# EAGLE design Dot (EAGLE 9.2.2)
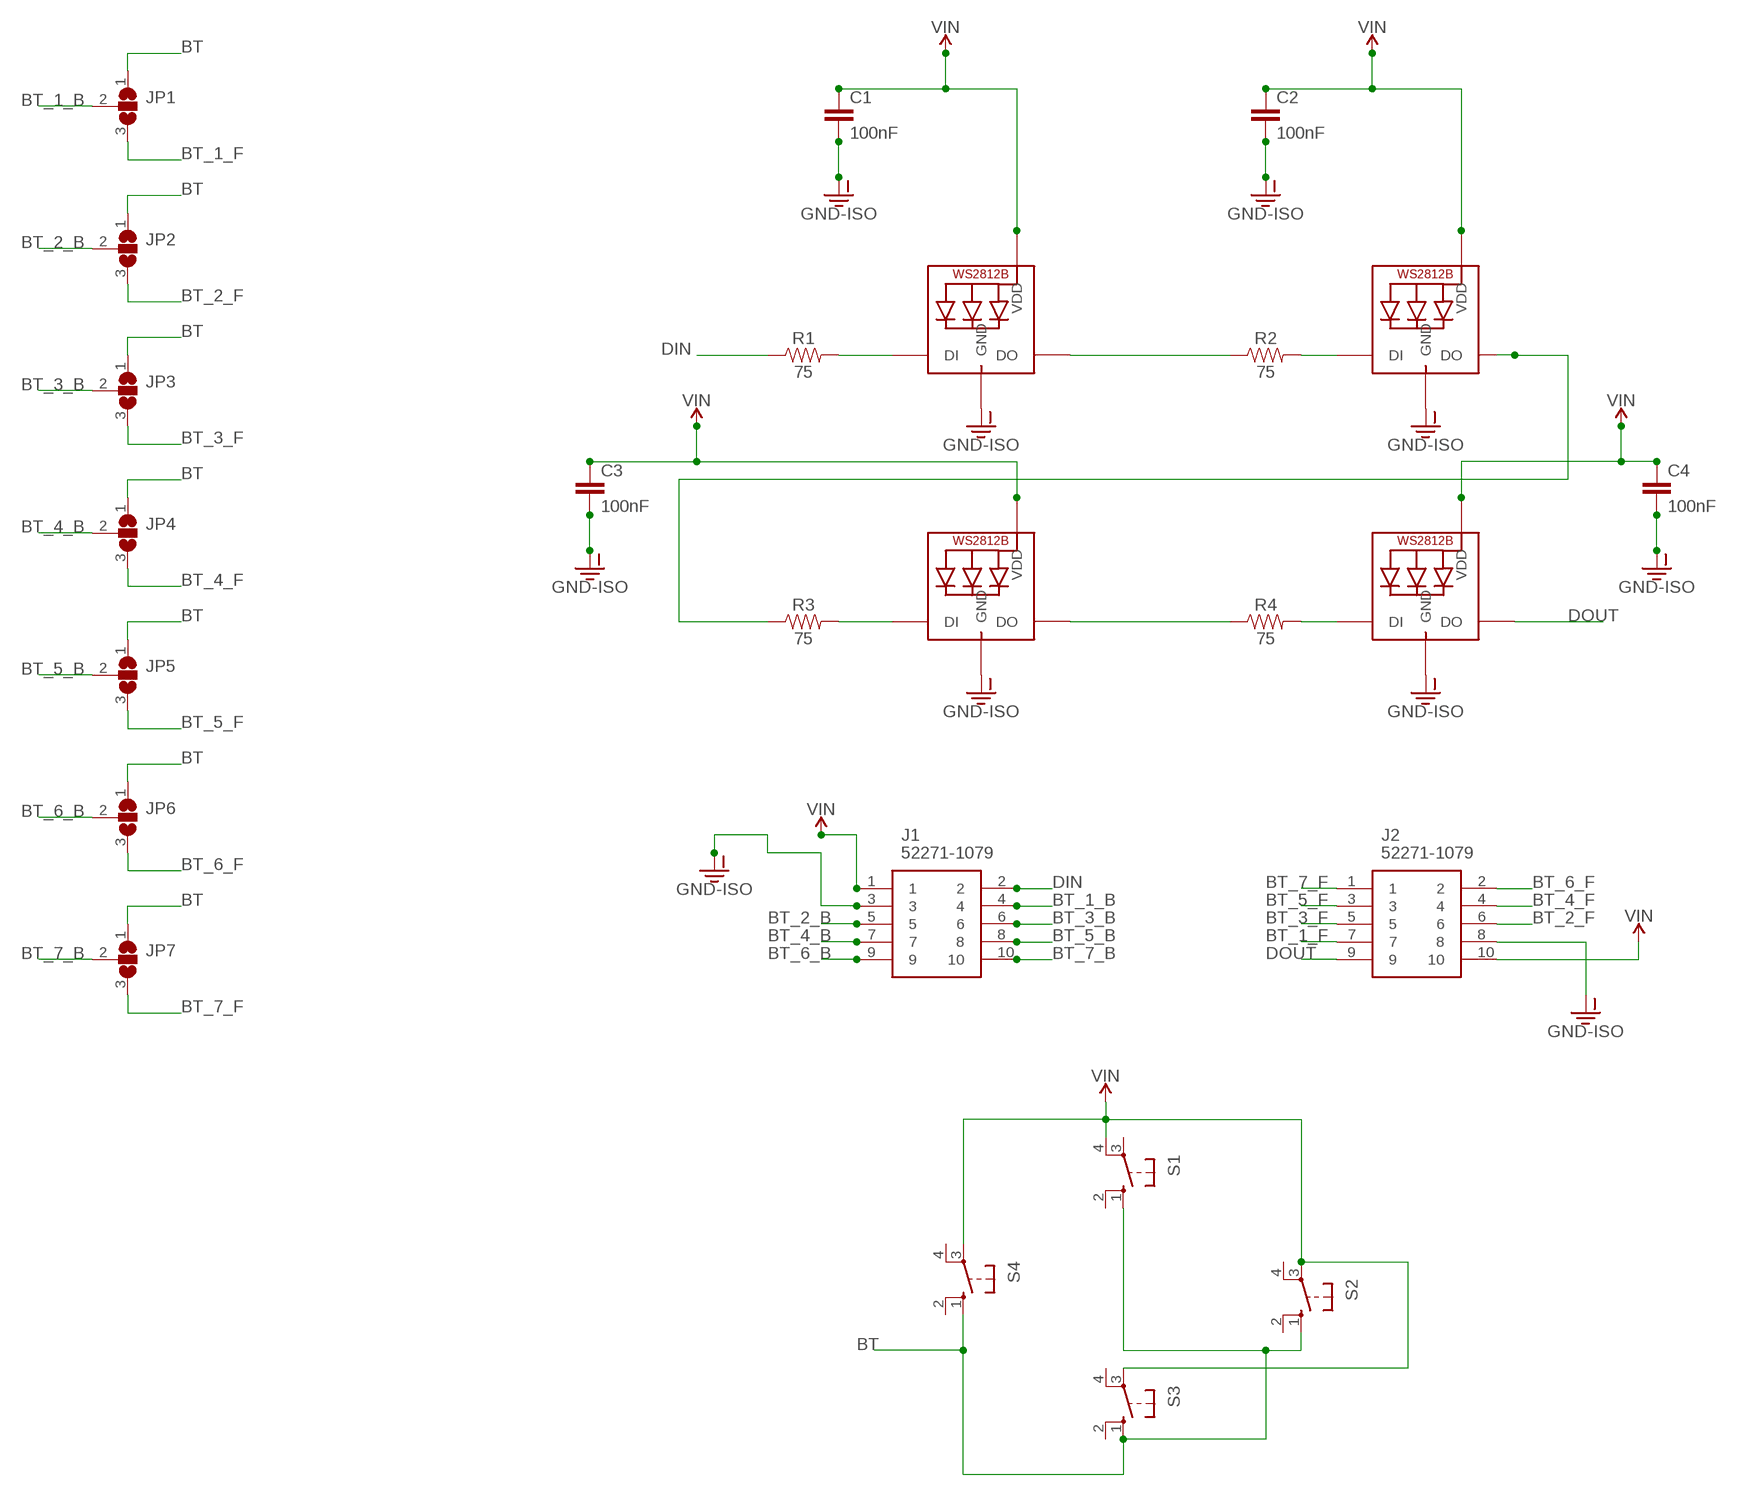
[diagram p0: schematic, sheet 1]

## Parts
C1  100nF  100PF-0603-50V-5%  [0603]
C2  100nF  100PF-0603-50V-5%  [0603]
C3  100nF  100PF-0603-50V-5%  [0603]
C4  100nF  100PF-0603-50V-5%  [0603]
J1  52271-1079  [52271-1079]
J2  52271-1079  [52271-1079]
JP1  SJ2W  [SJ_2]
JP2  SJ2W  [SJ_2]
JP3  SJ2W  [SJ_2]
JP4  SJ2W  [SJ_2]
JP5  SJ2W  [SJ_2]
JP6  SJ2W  [SJ_2]
JP7  SJ2W  [SJ_2]
LED1  WS2812B5050  [WS2812B]
LED2  WS2812B5050  [WS2812B]
LED3  WS2812B5050  [WS2812B]
LED4  WS2812B5050  [WS2812B]
R1  75  75KOHM-0603-1/10W-1%  [0603]
R2  75  75KOHM-0603-1/10W-1%  [0603]
R3  75  75KOHM-0603-1/10W-1%  [0603]
R4  75  75KOHM-0603-1/10W-1%  [0603]
S1  10-XX  [B3F-10XX]
S2  10-XX  [B3F-10XX]
S3  10-XX  [B3F-10XX]
S4  10-XX  [B3F-10XX]

## Nets
BT: JP1.1 JP2.1 JP3.1 JP4.1 JP5.1 JP6.1 JP7.1 S1.1(S) S2.1(S) S3.1(S) S4.1(S)
BT_1_B: J1.4 JP1.2
BT_1_F: J2.7 JP1.3
BT_2_B: J1.5 JP2.2
BT_2_F: J2.6 JP2.3
BT_3_B: J1.6 JP3.2
BT_3_F: J2.5 JP3.3
BT_4_B: J1.7 JP4.2
BT_4_F: J2.4 JP4.3
BT_5_B: J1.8 JP5.2
BT_5_F: J2.3 JP5.3
BT_6_B: J1.9 JP6.2
BT_6_F: J2.2 JP6.3
BT_7_B: J1.10 JP7.2
BT_7_F: J2.1 JP7.3
DIN: J1.2 R1.1
DOUT: J2.9 LED4.2-DOUT(DO)
GND-ISO [power]: C1.2 C2.2 C3.2 C4.2 J1.3 J2.8 LED1.3-GND(GND) LED2.3-GND(GND) LED3.3-GND(GND) LED4.3-GND(GND)
N$1: LED2.2-DOUT(DO) R3.1
N$3: LED1.4-DIN(DI) R1.2
N$4: LED1.2-DOUT(DO) R2.1
N$5: LED2.4-DIN(DI) R2.2
N$6: LED3.4-DIN(DI) R3.2
N$7: LED3.2-DOUT(DO) R4.1
N$8: LED4.4-DIN(DI) R4.2
VIN [power]: C1.1 C2.1 C3.1 C4.1 J1.1 J2.10 LED1.1-VDD(VDD) LED2.1-VDD(VDD) LED3.1-VDD(VDD) LED4.1-VDD(VDD) S1.4(P1) S2.3(P) S3.3(P) S4.3(P)
Unconnected: S1.2(S1) S1.3(P) S2.2(S1) S2.4(P1) S3.2(S1) S3.4(P1) S4.2(S1) S4.4(P1)

## Library data of the parts
C1-C4 = SparkFun-Capacitors:100PF: 100pF/0.1nF ceramic capacitors A capacitor is a passive two-terminal electrical component used to store electrical energy temporarily in an electric field.; PROD_ID: CAP-07883; VALUE: 100pF
J1 J2 = 52271-1079:52271-1079: 1.0MM FPC R/A CONN 10 W Molex FFC/FPC SMT Series 1mm Pitch 10 Way Right Angle SMT Female FPC Connector, ZIF Bottom Contact Source: Datasheet <http://uk.rs-online.com/web/p/products/5144329P>; ALLIED_NUMBER: 70373119; DESCRIPTION: 1.0MM FPC R/A CONN 10 W Molex FFC/FPC SMT Series 1mm Pitch 10 Way Right Angle SMT Female FPC Connector, ZIF Bottom Contact; HEIGHT: mm; MANUFACTURER_NAME: Molex; MANUFACTURER_PART_NUMBER: 52271-1079; RS_PART_NUMBER: 5144329P
JP1-JP7 = jumper:SJ2W: SMD solder JUMPER
LED1-LED4 = adafruit:WS2812B
R1-R4 = SparkFun-Resistors:75KOHM: 75Ω resistor A resistor is a passive two-terminal electrical component that implements electrical resistance as a circuit element. Resistors act to reduce current flow, and, at the same time, act to lower voltage levels within circuits. - Wikipedia; PROD_ID: RES-09737
S1-S4 = switch-omron:10-XX: OMRON SWITCH; MPN: B3F-1000; OC_FARNELL: 176432; OC_NEWARK: 36M3542

## Net classes
0 default: width 0.254 mm, drill 0.508 mm, clearance 0.254 mm
1 power: width 0.508 mm, drill 0.635 mm, clearance 0.381 mm

## Board
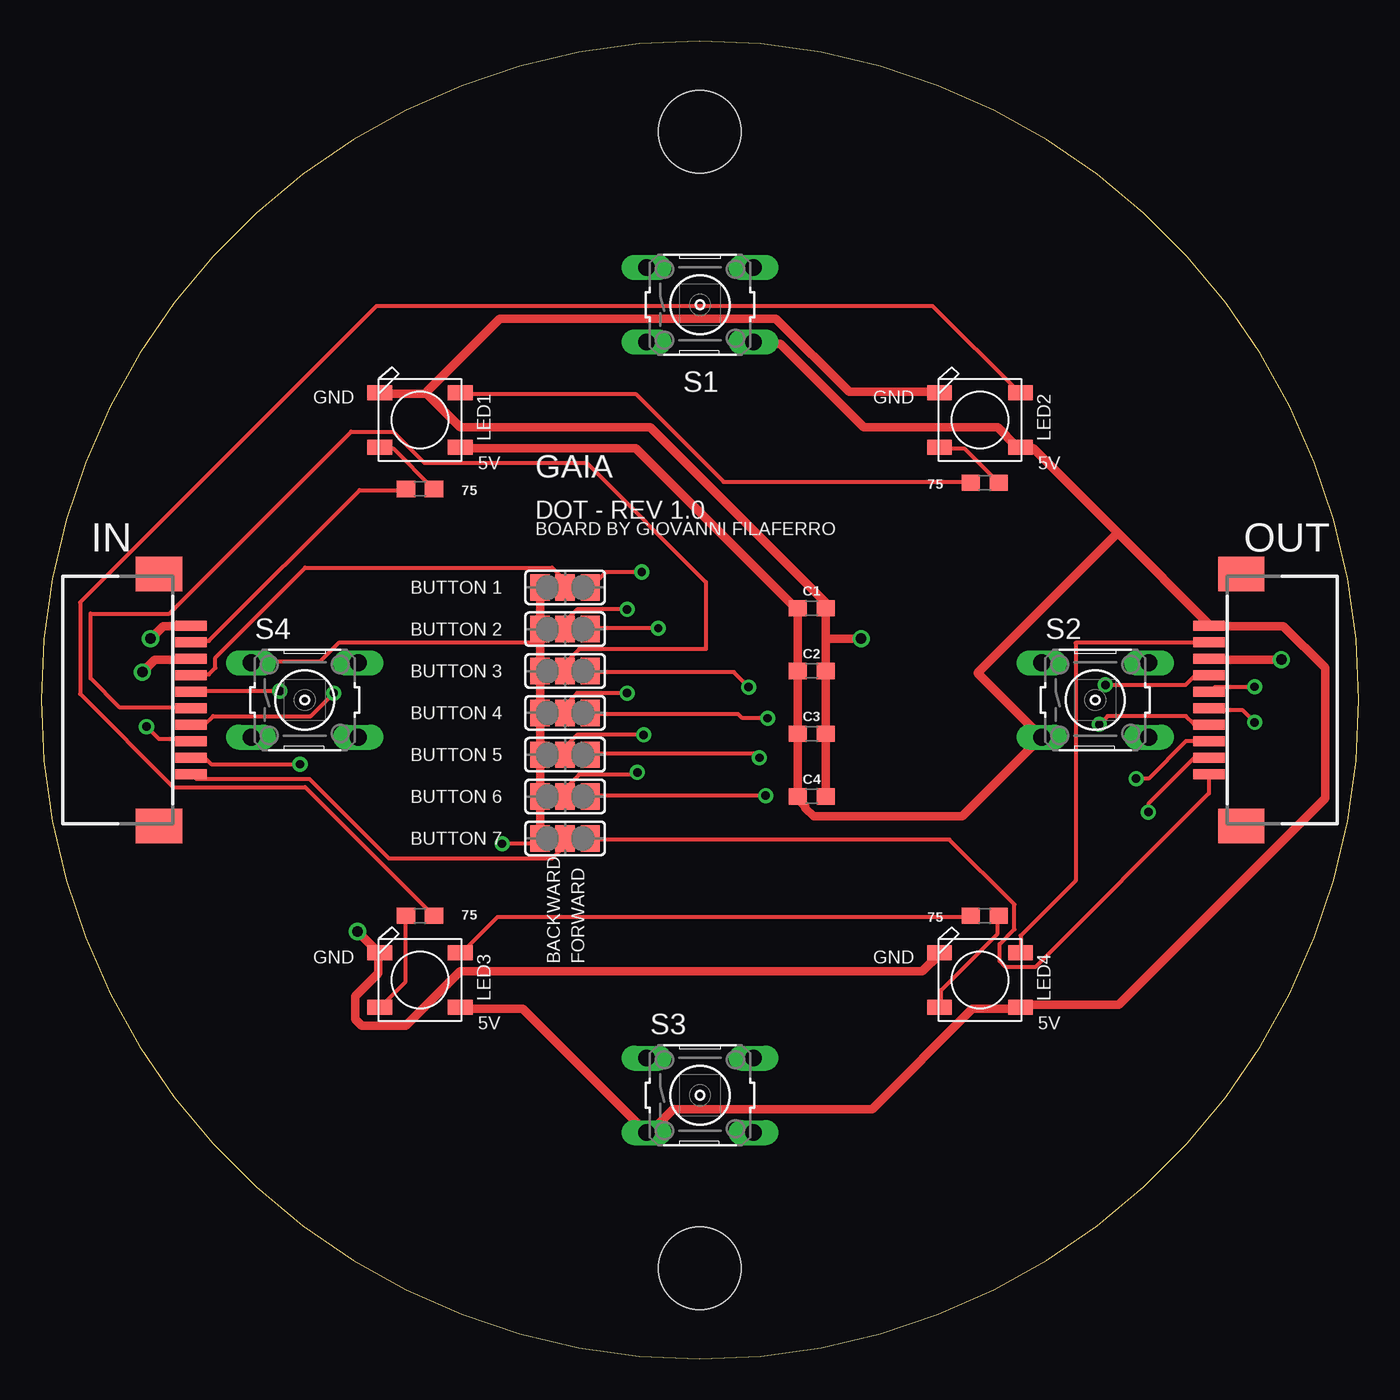
[diagram p1: board, top side]
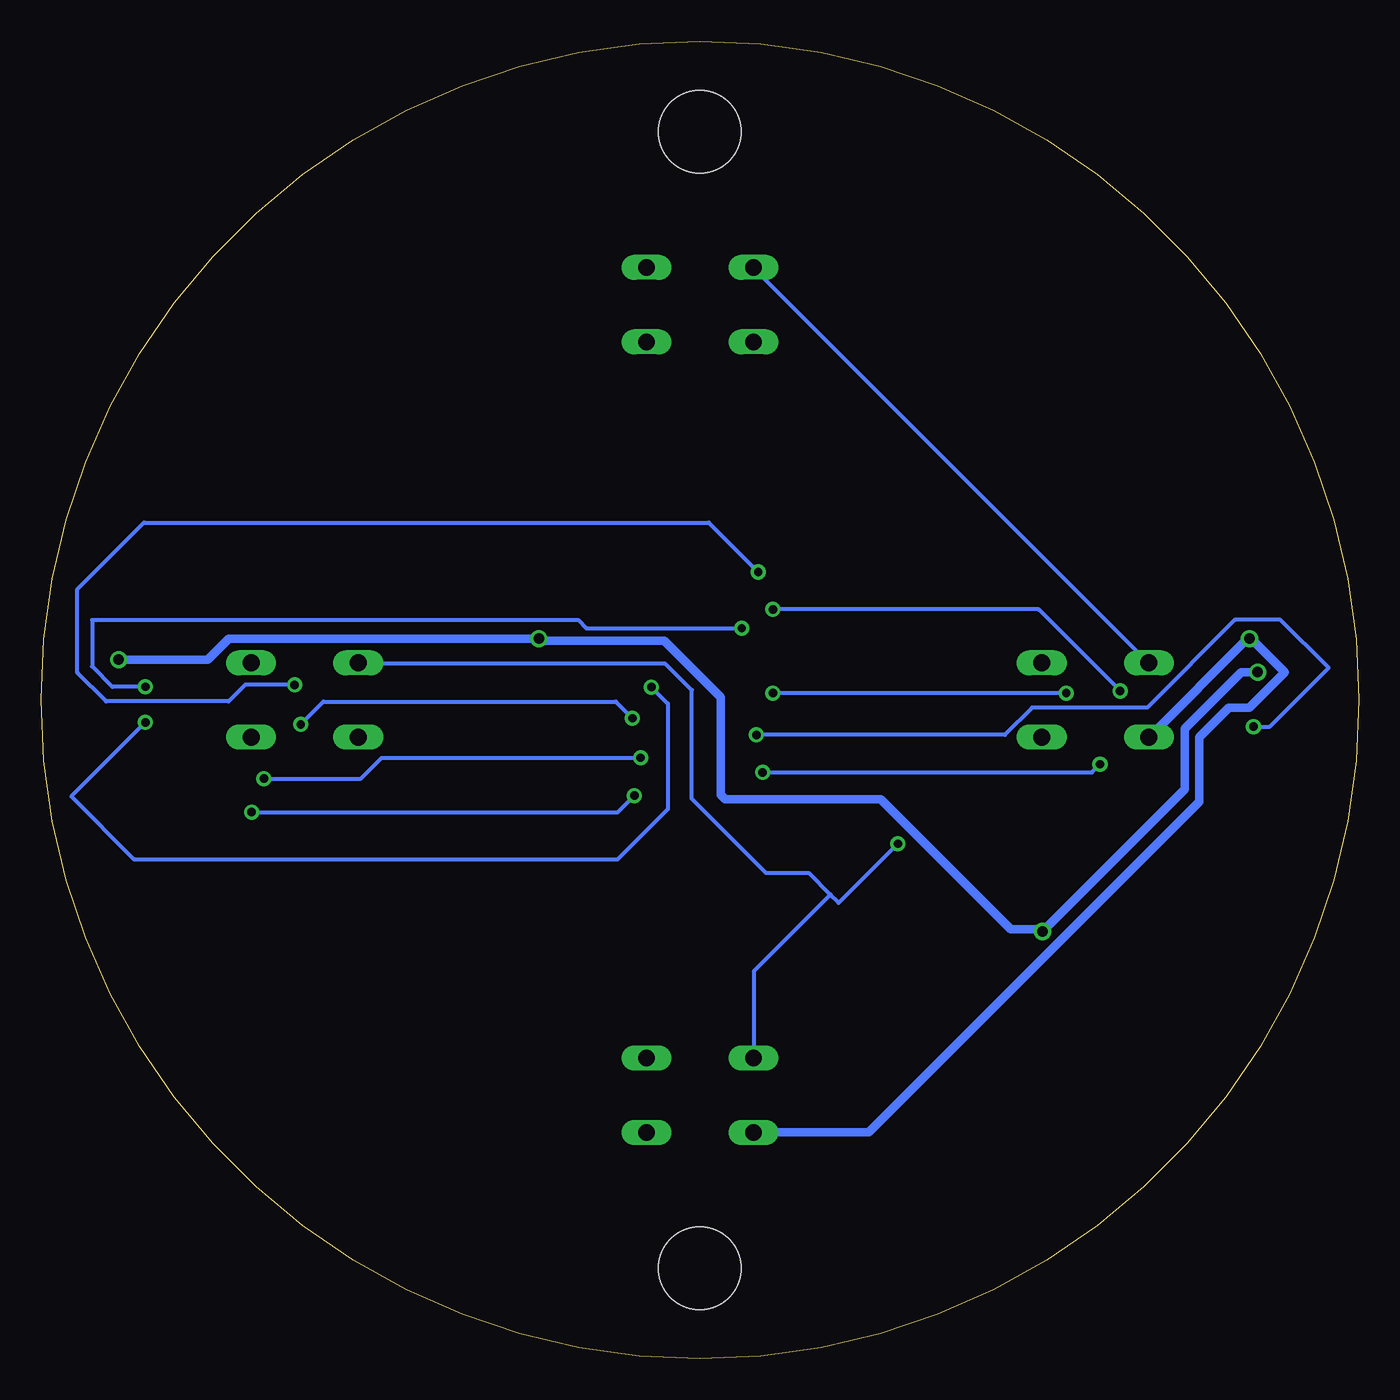
[diagram p2: board, bottom side, seen from below]

Size 80 x 80 mm. Coordinates in mm from the lower left corner, seen from the top.
Outline: 0,40 arc90 40,0 arc90 80,40 arc90 40,80 arc90 0,40
Copper layers (1*16): Top 0.035mm / dielectric 1.5mm / Bottom 0.035mm
Design rules "default": minimum track width 6mil, minimum drill 0.35mm, track to track 6mil, track to pad 6mil, pad to pad 6mil, via to via 6mil, smd to smd 6mil, copper to edge 40mil, drill to drill 6mil, minimum pad ring 10mil, minimum via ring 8mil, stop-mask expansion 4mil, vias tented up to drill 0mil, thermal gap 10mil
Holes 5 mm at 40,74.5 40,5.5

### Footprints (pad centres in the part's own frame; a part is rotated, then mirrored left to right if it is on the bottom)
0603 = smd 1.1 x 1: 1 -0.85,0; 2 0.85,0
52271-1079 = smd 0.6 x 1.9: 1 -4.5,1.1; 2 -3.5,1.1; 3 -2.5,1.1; 4 -1.5,1.1; 5 -0.5,1.1; 6 0.5,1.1; 7 1.5,1.1; 8 2.5,1.1; 9 3.5,1.1; 10 4.5,1.1 | smd 2.1 x 2.8: 11 7.65,-0.85; 12 -7.65,-0.85
SJ_2 = smd 1.168 x 1.6: 1 -1.524,0; 2 0,0; 3 1.524,0
WS2812B = smd 1.5 x 0.9: 1-VDD 2.45,-1.65; 2-DOUT 2.45,1.65; 3-GND -2.45,1.65; 4-DIN -2.45,-1.65
B3F-10XX = drill 1.016 long: 1 -3.251,2.261; 2 3.251,2.261; 3 -3.251,-2.261; 4 3.251,-2.261

### Placement (x,y rotation side)
C1  46.78,45.57 0 top
C2  46.78,41.76 0 top
C3  46.78,37.95 0 top
C4  46.78,34.14 0 top
J1  8,40 270 top
J2  72,40 90 top
JP1  31.81,46.84 0 top
JP2  31.81,44.3 0 top
JP3  31.81,41.76 0 top
JP4  31.81,39.22 0 top
JP5  31.81,36.68 0 top
JP6  31.81,34.14 0 top
JP7  31.81,31.6 0 top
LED1  23,57 0 top
LED2  57,57 0 top
LED3  23,23 0 top
LED4  57,23 0 top
R1  23,52.81 0 top
R2  57.29,53.19 0 top
R3  23,26.9 180 top
R4  57.29,26.9 0 top
S1  40,64 0 top
S2  64,40 0 top
S3  40,16 0 top
S4  16,40 0 top

### Tracks (layer width: path | path; a pad name or v marks a point on that pad's centre or on a via)
BT  (via drill 0.51)
  Top 0.254: 30.29,43.47 18.06,43.47 16.92,42.33 12.86,42.33 S4.1 | v27.98,31.28 30,31.28 30.13,31.4 JP7.1
  Top 0.508: JP1.1 JP2.1 30.29,43.47 JP3.1 JP4.1 JP5.1 JP6.1 JP7.1
  Bottom 0.254: v27.98,31.28 31.58,27.68 32.08,28.18 | 32.08,28.18 36.73,23.53 36.73,18.32 S3.1 | S1.1 36.73,66.2 12.86,42.33 S4.1 | S2.1 60.73,42.2 42.1,42.2 40.5,40.6 40.5,34 36,29.5 33.4,29.5 32.08,28.18
BT_1_B
  Top 0.254: JP1.2 31.78,46.9 31.78,47.28 31.02,48.04 16.03,48.04 10.57,42.58 10.57,41.94 10.19,41.56 9.17,41.56 J1.4
BT_1_F  (via drill 0.51)
  Top 0.254: v36.46,47.77 34.26,47.77 JP1.3 | v64.62,40.92 69.49,40.92 70.01,41.44 70.9,41.44 J2.7
  Bottom 0.254: v36.46,47.77 39.46,50.77 73.77,50.77 77.8,46.73 77.8,41.66 76.05,39.91 68.62,39.91 67.62,40.92 v64.62,40.92
BT_2_B  (via drill 0.51)
  Top 0.254: v35.57,45.5 32.54,45.5 31.91,44.87 31.91,44.36 JP2.2 | v14.49,40.55 9.17,40.55 J1.5
  Bottom 0.254: v35.57,45.5 19.44,45.5 v14.49,40.55
BT_2_F  (via drill 0.51)
  Top 0.254: v37.46,44.36 33.43,44.36 JP2.3 | v73.67,40.8 71.28,40.8 71.02,40.55 J2.6
  Bottom 0.254: v37.46,44.36 46.89,44.36 47.4,44.87 76.91,44.87 76.91,42.04 75.67,40.8 v73.67,40.8
BT_3_B
  Top 0.254: JP3.2 31.91,41.82 31.91,42.33 32.67,43.09 40.35,43.09 40.35,47.15 33.11,54.39 23.27,54.39 21.36,56.3 18.82,56.3 7.78,45.25 3,45.25 3,41.31 4.78,39.53 9.05,39.53 J1.6
BT_3_F  (via drill 0.51)
  Top 0.254: v42.95,40.78 42.05,41.69 33.43,41.69 JP3.3 | v73.67,38.64 72.91,39.4 71.02,39.4 J2.5
  Bottom 0.254: v42.95,40.78 41.95,39.78 41.95,33.37 44.99,30.34 74.37,30.34 78.17,34.14 v73.67,38.64
BT_4_B  (via drill 0.51)
  Top 0.254: v35.57,40.42 32.54,40.42 31.91,39.78 31.91,39.28 JP4.2 | v17.76,40.42 16.36,39.02 10.44,39.02 9.94,38.52 9.17,38.52 J1.7
  Bottom 0.254: v17.76,40.42 v35.57,40.42
BT_4_F  (via drill 0.51)
  Top 0.254: v44.11,38.9 42.57,38.9 42.32,39.15 33.43,39.15 JP4.3 | v64.24,38.52 64.74,39.02 69.5,39.02 70.01,38.52 70.9,38.52 J2.4
  Bottom 0.254: v64.24,38.52 62.87,39.9 45.11,39.9 v44.11,38.9
BT_5_B  (via drill 0.51)
  Top 0.254: v36.57,37.88 32.54,37.88 31.91,37.24 31.91,36.74 JP5.2 | v6.39,38.39 7.16,37.63 9.05,37.63 J1.8
  Bottom 0.254: v36.57,37.88 21.49,37.88 19.84,39.53 12.86,39.53 7.52,44.87 4.76,44.87 1.84,41.94 5.39,38.39 v6.39,38.39
BT_5_F  (via drill 0.51)
  Top 0.254: v43.61,36.49 43.36,36.74 33.43,36.74 JP5.3 | v66.48,35.23 67.24,35.23 69.51,37.5 J2.3
  Bottom 0.254: v43.61,36.49 59.33,36.49 60.59,35.23 v66.48,35.23
BT_6_B  (via drill 0.51)
  Top 0.254: v36.2,35.6 36.06,35.47 32.67,35.47 31.91,34.7 31.91,34.2 JP6.2 | v15.71,36.1 10.32,36.1 9.94,36.48 9.17,36.48 J1.9
  Bottom 0.254: v36.2,35.6 16.21,35.6 v15.71,36.1
BT_6_F  (via drill 0.51)
  Top 0.254: v43.98,34.2 33.43,34.2 JP6.3 | v67.22,33.2 67.22,33.7 70.01,36.48 70.9,36.48 J2.2
  Bottom 0.254: v67.22,33.2 44.98,33.2 v43.98,34.2
BT_7_B
  Top 0.254: JP7.2 31.78,31.53 31.78,31.15 31.02,30.39 21.11,30.39 16.29,35.21 9.43,35.21 9.17,35.47 J1.10
BT_7_F
  Top 0.254: JP7.3 33.43,31.53 55.15,31.53 59.08,27.59 59.08,26.07 58.2,25.18 58.2,24.16 58.58,23.78 60.35,23.78 70.9,34.32 70.9,35.47 J2.1
DIN
  Top 0.254: R1.1 22.13,52.74 19.33,52.74 10.19,43.59 9.17,43.59 J1.2
DOUT
  Top 0.254: LED4.2-DOUT 59.47,24.67 59.47,25.69 62.81,29.03 62.81,43.47 70.9,43.47 J2.9
GND-ISO  (via drill 0.64)
  Top 0.508: 47.63,43.72 C1.2 47.78,45.75 36.99,56.55 25.43,56.55 23.4,58.58 | 47.63,43.72 C2.2 C3.2 C4.2 | LED4.3-GND 54.51,24.55 53.5,23.53 25.43,23.53 22.13,20.23 19.46,20.23 19.08,20.61 19.08,22 20.48,23.4 20.48,24.55 LED3.3-GND 20.35,24.8 v19.21,25.94 | v6.14,41.69 6.9,42.45 9.05,42.45 J1.3 | 23.4,58.58 20.6,58.58 LED1.3-GND | LED2.3-GND 54.51,58.71 49.05,58.71 44.61,63.15 27.84,63.15 23.4,58.71 23.4,58.58 | v75.3,42.45 71.02,42.45 J2.8 | v49.78,43.72 47.63,43.72
  Bottom 0.508: v6.14,41.69 7.14,41.69 10.57,38.26 10.57,34.58 v19.21,25.94 19.33,26.07 21.13,26.07 29.02,33.96 38.46,33.96 38.74,34.24 38.74,40.16 42.18,43.59 49.65,43.59 v49.78,43.72 68.61,43.72 69.88,42.45 v75.3,42.45
N$1
  Top 0.254: R3.1 23.78,26.96 16.03,34.7 8.03,34.7 2.36,40.37 2.36,45.93 20.35,63.91 54.13,63.91 59.34,58.71 LED2.2-DOUT
N$3
  Top 0.254: R1.2 23.78,52.87 21.36,55.28 20.6,55.28 LED1.4-DIN
N$4
  Top 0.254: R2.1 56.42,53.25 41.43,53.25 36.1,58.58 25.56,58.58 LED1.2-DOUT
N$5
  Top 0.254: R2.2 58.07,53.25 56.04,55.28 54.64,55.28 LED2.4-DIN
N$6
  Top 0.254: R3.2 22.13,26.83 22.13,22.89 20.6,21.37 LED3.4-DIN
N$7
  Top 0.254: R4.1 56.42,26.83 27.71,26.83 25.56,24.67 LED3.2-DOUT
N$8
  Top 0.254: R4.2 58.07,26.83 58.07,25.82 54.64,22.39 54.64,21.37 LED4.4-DIN
VIN  (via drill 0.64)
  Top 0.508: LED1.1-VDD 25.56,55.28 36.1,55.28 45.75,45.63 C1.1 C2.1 C3.1 C4.1 46,33.94 46.38,33.56 46.38,33.44 46.89,32.93 55.91,32.93 60.61,37.63 S2.3 56.86,41.63 56.86,41.64 65.36,50.14 | 65.36,50.14 70.9,44.61 J2.10 71.15,44.48 75.42,44.48 77.96,41.94 77.96,34.02 65.43,21.5 59.59,21.5 LED4.1-VDD 59.34,21.24 56.54,21.24 50.45,15.15 38.38,15.15 36.99,13.75 S3.3 36.73,13.75 29.24,21.24 25.56,21.24 LED3.1-VDD | 65.36,50.14 60.23,55.28 59.47,55.28 LED2.1-VDD 59.21,55.41 58.07,56.55 49.94,56.55 44.86,61.63 43.34,61.63 S1.4 | v6.64,43.72 7.4,44.48 9.05,44.48 J1.1
  Bottom 0.508: S4.3 12.73,37.75 6.7,43.78 v6.64,43.72 6.58,43.78 4.49,41.69 6.65,39.53 7.9,39.53 9.68,37.75 9.68,33.82 29.75,13.75 36.73,13.75 S3.3

### Text on the board
tNames: GND | GND | 5V | GAIA | 5V | DOT - REV 1.0 | IN | BOARD BY GIOVANNI FILAFERRO | OUT | BUTTON 1 | BUTTON 2 | BUTTON 3 | BUTTON 4 | BUTTON 5 | BUTTON 6 | BUTTON 7 | GND | BACKWARD | FORWARD | GND | 5V | 5V